# EasyEDA Pro project P1.eprj, board PCB
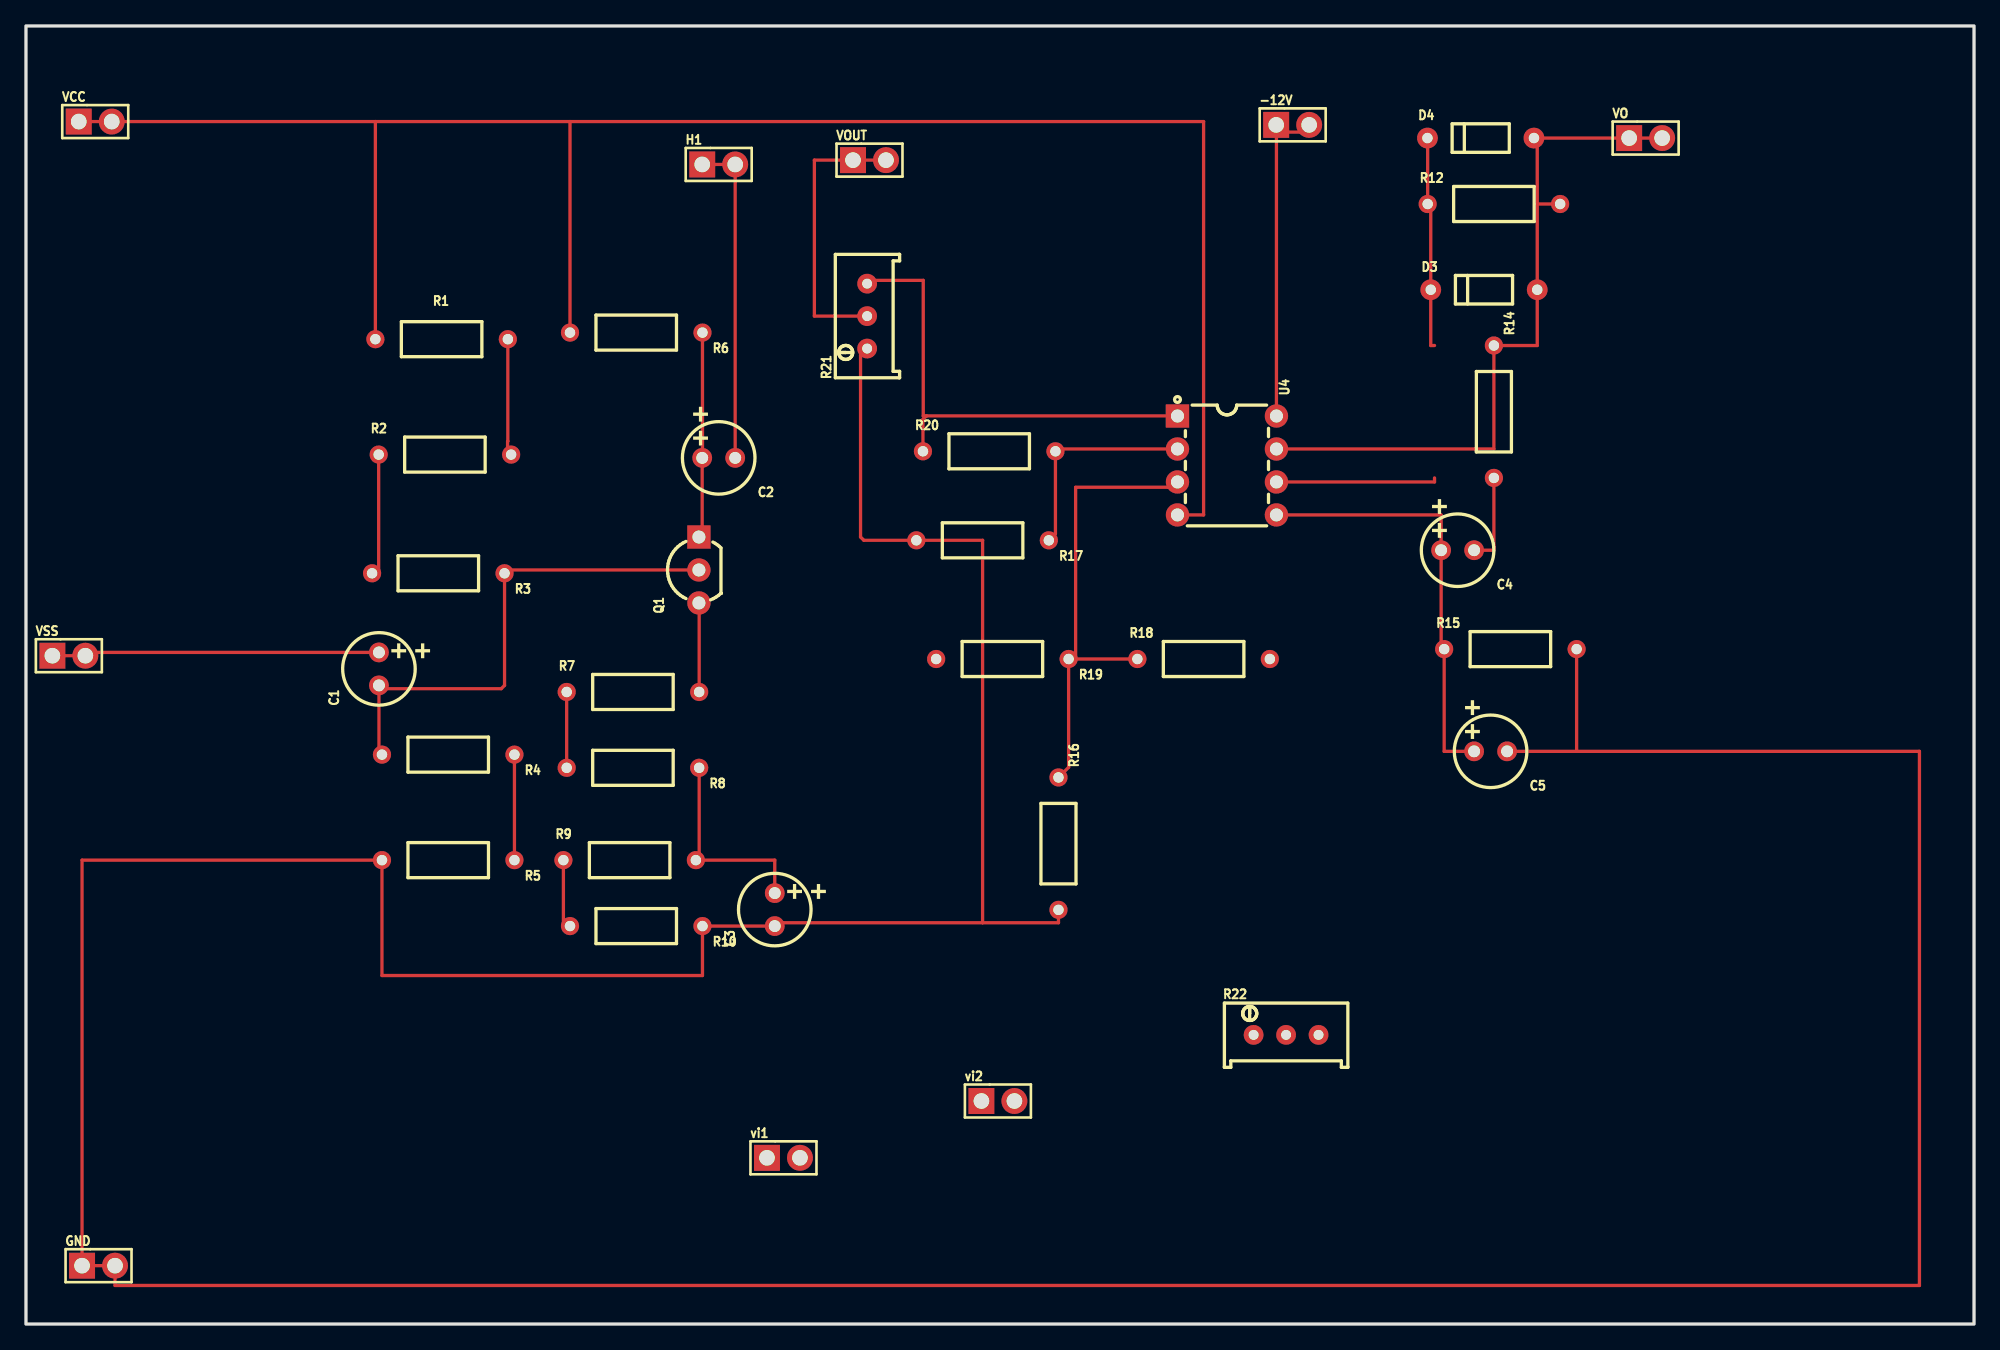
[diagram p6: board, top side]
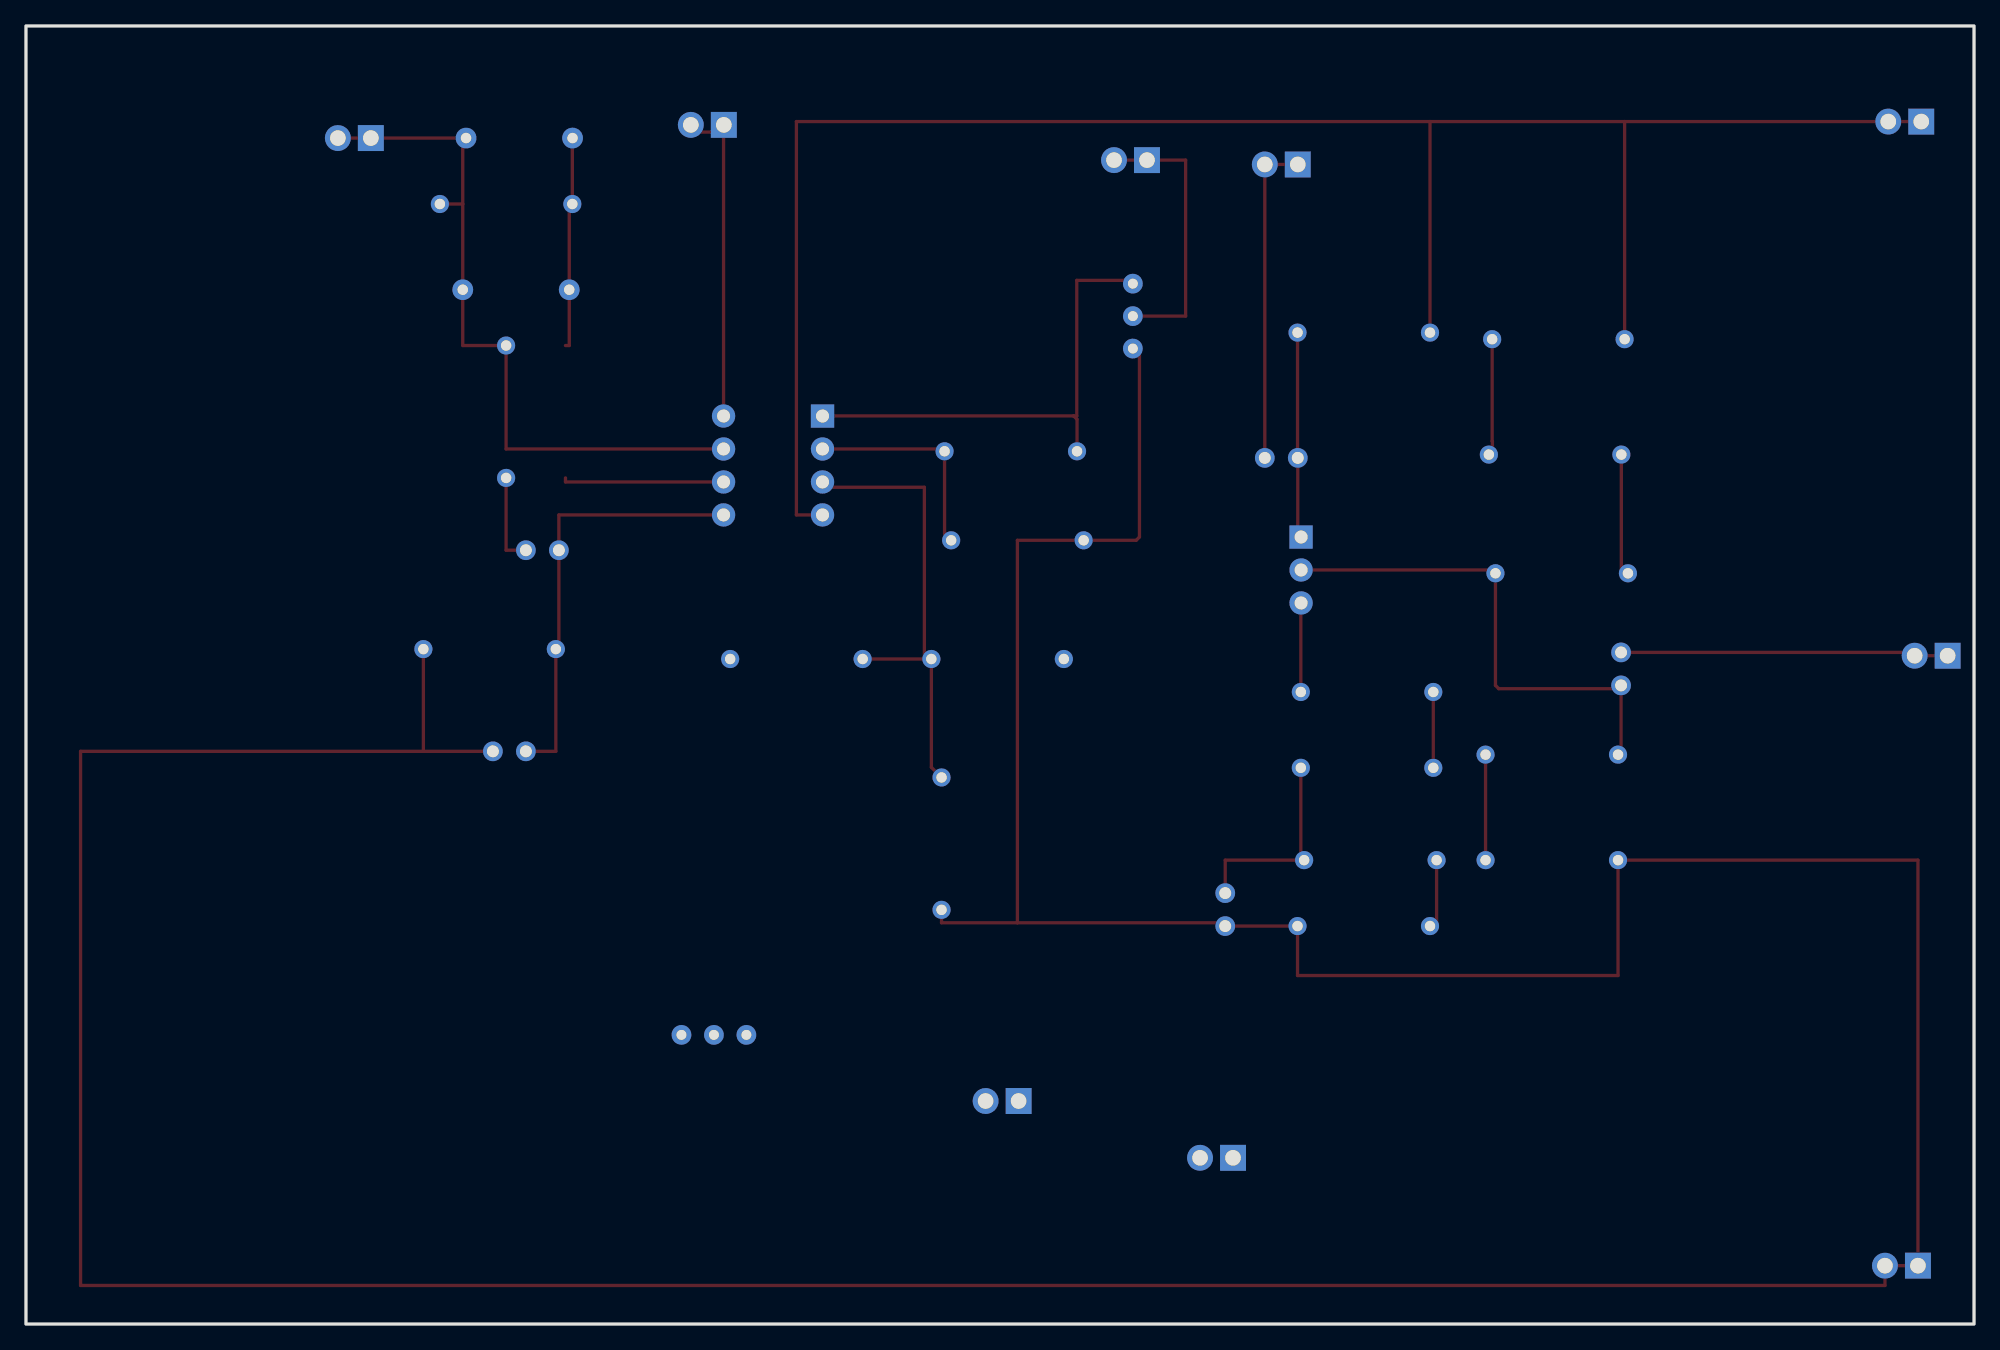
[diagram p7: board, bottom side, seen from below]

Outline 150 x 100 mm; copper layers: Top Layer, Bottom Layer. Coordinates in mm from the lower left corner of the outline.
Outline path: rectangle 0,0 150,100
Stack: Top Layer 0.035mm / Dielectric1 1.51mm FR4 er 4.5 / Bottom Layer 0.035mm

## Design rules (mm)
spacing safeClearance (default): track to track 0.152, other pairs 0.152 to 0.3
track width trackWidth (default): min 0.127, default 0.254, max 2.54
differential pair differentialPair (default): width min 0.127, default 0.254, max 2.54; gap min 0.152, default 0.152
via viaSize (default): diameter min 0.5, default 0.61, max 10; hole min 0.3, default 0.305, max 6

## Placement (name value [footprint] x y rotation side)
-12V  PZ254V-11-02P  [HDR-TH_2P-P2.54-V-M]  97.54 92.38 0 top
C1  10uF  [CAP-TH_BD5.5-P2.54-D0.5-FD]  27.18 50.47 90 top
C2  10uF  [CAP-TH_BD5.5-P2.54-D0.5-FD]  53.34 66.73 180 top
C3  100uF  [CAP-TH_BD5.5-P2.54-D0.5-FD]  57.66 31.93 90 top
C4  0.047uF  [CAP-TH_BD5.5-P2.54-D0.5-FD]  110.24 59.61 180 top
C5  0.047uF  [CAP-TH_BD5.5-P2.54-D0.5-FD]  112.78 44.12 180 top
D3  1N4148  [DO-35_BD2.0-L4.2-P8.20-D0.5-RD]  112.27 79.68 0 top
D4  1N4148  [DO-35_BD2.0-L4.2-P8.20-D0.5-RD]  112.01 91.36 0 top
GND  PZ254V-11-02P  [HDR-TH_2P-P2.54-V-M]  5.59 4.5 0 top
H1  PZ254V-11-02P  [HDR-TH_2P-P2.54-V-M]  53.34 89.33 0 top
Q1  2N2222A  [TO-92-3_L4.8-W3.7-P2.54-R]  51.82 58.09 90 top
R1  51K  [RES-TH_BD2.7-L6.2-P10.20-D0.4]  32 75.87 180 top
R2  51K  [RES-TH_BD2.7-L6.2-P10.20-D0.4]  32.26 66.98 0 top
R3  51K  [RES-TH_BD2.7-L6.2-P10.20-D0.4]  31.75 57.84 180 top
R4  51K  [RES-TH_BD2.7-L6.2-P10.20-D0.4]  32.51 43.87 180 top
R5  15K  [RES-TH_BD2.7-L6.2-P10.20-D0.4]  32.51 35.74 180 top
R6  2.2k  [RES-TH_BD2.7-L6.2-P10.20-D0.4]  46.99 76.38 180 top
R7  100  [RES-TH_BD2.7-L6.2-P10.20-D0.4]  46.74 48.69 0 top
R8  39  [RES-TH_BD2.7-L6.2-P10.20-D0.4]  46.74 42.85 180 top
R9  560  [RES-TH_BD2.7-L6.2-P10.20-D0.4]  46.48 35.74 0 top
R10  220  [RES-TH_BD2.7-L6.2-P10.20-D0.4]  46.99 30.66 180 top
R12  10K  [RES-TH_BD2.7-L6.2-P10.20-D0.4]  113.03 86.28 0 top
R14  3.3k  [RES-TH_BD2.7-L6.2-P10.20-D0.4]  113.03 70.28 270 top
R15  3.3K  [RES-TH_BD2.7-L6.2-P10.20-D0.4]  114.3 51.99 0 top
R16  20k  [RES-TH_BD2.7-L6.2-P10.20-D0.4]  79.5 37.01 270 top
R17  4.7K  [RES-TH_BD2.7-L6.2-P10.20-D0.4]  73.66 60.38 180 top
R18  20k  [RES-TH_BD2.7-L6.2-P10.20-D0.4]  90.68 51.23 0 top
R19  20K  [RES-TH_BD2.7-L6.2-P10.20-D0.4]  75.18 51.23 180 top
R20  47K  [RES-TH_BD2.7-L6.2-P10.20-D0.4]  74.17 67.23 0 top
R21  100kΩ  [RES-ADJ-TH_3P-L10.0-W10.0-P2.50-L]  64.77 77.65 90 top
R22  20kΩ  [RES-ADJ-TH_3P-L10.0-W10.0-P2.50-L]  97.03 22.28 0 top
U4  NE5532N  [DIP-8_L9.3-W6.4-P2.54-LS7.6-BL]  92.48 66.14 270 top
VCC  PZ254V-11-02P  [HDR-TH_2P-P2.54-V-M]  5.33 92.63 0 top
vi1  PZ254V-11-02P  [HDR-TH_2P-P2.54-V-M]  58.33 12.81 0 top
vi2  PZ254V-11-02P  [HDR-TH_2P-P2.54-V-M]  74.84 17.18 0 top
VO  PZ254V-11-02P  [HDR-TH_2P-P2.54-V-M]  124.71 91.36 0 top
VOUT  PZ254V-11-02P  [HDR-TH_2P-P2.54-V-M]  64.95 89.67 0 top
VSS  PZ254V-11-02P  [HDR-TH_2P-P2.54-V-M]  3.3 51.49 0 top

## Footprints (pads in the part's own frame, mm; a bottom-side part is the same pattern mirrored in y, then rotated)
CAP-TH_BD5.5-P2.54-D0.5-FD
  round 1.524 hole 0.914: 1(-1.27,0) 2(1.27,0)
DIP-8_L9.3-W6.4-P2.54-LS7.6-BL
  rect 1.8x1.8 hole 1: 1(-3.81,-3.81)
  round 1.8 hole 1: 2(-1.27,-3.81) 3(1.27,-3.81) 4(3.81,-3.81) 5(3.81,3.81) 6(1.27,3.81) 7(-1.27,3.81) 8(-3.81,3.81)
DO-35_BD2.0-L4.2-P8.20-D0.5-RD
  round 1.6 hole 0.8: 1(-4.1,0) 2(4.1,0)
HDR-TH_2P-P2.54-V-M
  rect 2x2 hole 1.2: 1(-1.27,0)
  round 2 hole 1.2: 2(1.27,0)
RES-ADJ-TH_3P-L10.0-W10.0-P2.50-L
  round 1.524 hole 0.762: 1(-2.5,0) 2(0,0) 3(2.5,0)
RES-TH_BD2.7-L6.2-P10.20-D0.4
  round 1.4 hole 0.8: 1(-5.1,0) 2(5.1,0)
TO-92-3_L4.8-W3.7-P2.54-R
  rect 1.8x1.8 hole 1: 1(2.54,0)
  round 1.8 hole 1: 2(0,0) 3(-2.54,0)

## Nets
As in the schematic.

## Routing (per net, layer and track width the routed paths; a pad name or vN(x,y) marks a point on that pad's centre or on a via; arc(x,y) is an arc through that point)
$1N487: length 9.2
  Top Layer w0.254: R1.1 37.1,68.02 37.08,68 37.08,66.98 R2.2
$1N500: length 9.7
  Top Layer w0.254: R3.2 27.16,57.84 R2.1
$1N505: length 39
  Top Layer w0.254: R4.2 27.18,44.1 C1.1 27.43,48.95 36.6,48.95 36.85,49.2 R3.1 37.1,58.09 Q1.2
$1N510: length 8.1
  Top Layer w0.254: R4.1 R5.1
$1N539: length 25.3
  Top Layer w0.254: C1.2 4.83,51.74 VSS.2 VSS.1
$1N1031: length 16
  Top Layer w0.254: R6.1 52.09,66.75 C2.2 52.07,60.63 Q1.1
$1N1035: length 6.9
  Top Layer w0.254: R7.2 51.84,55.53 Q1.3
$1N1037: length 5.8
  Top Layer w0.254: R7.1 R8.2
$1N1039: length 15.7
  Top Layer w0.254: C3.2 57.66,35.74 51.84,35.74 ; R8.1 51.84,35.74 ; 51.84,35.74 R9.2
$1N1078: length 5.6
  Top Layer w0.254: R9.1 41.38,30.66 R10.2
$1N5445: length 397.8
  Top Layer w0.254: 73.66,30.91 57.66,30.91 C3.1 R10.1 52.09,26.85 27.41,26.85 R5.2 4.32,35.74 GND.1 GND.2 6.86,2.97 145.8,2.97 145.8,44.12 119.4,44.12 ; 73.66,30.91 79.5,30.91 R16.2 ; 73.66,30.91 73.66,60.38 R17.2 64.52,60.38 64.26,60.63 64.26,74.64 R21.1 ; R15.2 119.4,44.12 ; 119.4,44.12 C5.1
$1N5507: length 7.1
  Top Layer w0.254: C4.1 113.03,59.61 R14.2
$1N5529: length 16.5
  Top Layer w0.254: 108.46,75.38 108.17,75.38 D3.1 108.17,86.28 R12.1 107.93,91.36 D4.1
$1N5558: length 12.5
  Top Layer w0.254: U4.6 108.46,64.87 108.46,65.18
$1N5603: length 33.4
  Top Layer w0.254: C5.2 109.2,44.12 R15.1 108.97,51.99 C4.2 108.97,62.33 U4.5
$1N5613: length 151.9
  Top Layer w0.254: U4.4 90.68,62.33 90.68,92.63 41.89,92.63 ; 41.89,92.63 R6.2 ; 41.89,92.63 26.9,92.63 ; 26.9,92.63 VCC.2 VCC.1 ; 26.9,92.63 R1.2
$1N5755: length 25.4
  Top Layer w0.254: U4.8 96.29,92.36 ; 96.29,92.36 96.29,92.38 -12V.1 ; 96.29,92.36 96.82,91.82 98.25,91.82 -12V.2
$1N6867: length 36.3
  Top Layer w0.254: R16.1 80.28,42.89 R19.1 80.82,51.23 ; 80.82,51.23 R18.1 ; 80.82,51.23 80.82,64.46 88.72,64.46 88.72,64.82 U4.3
$1N6870: length 16.5
  Top Layer w0.254: R17.1 79.27,60.88 R20.2 79.45,67.41 U4.2
$1N6998: length 37.3
  Top Layer w0.254: 69.32,69.95 69.09,69.95 69.09,80.4 65.02,80.4 R21.3 ; 69.32,69.95 69.33,69.96 88.66,69.96 U4.1 ; 69.32,69.95 69.07,69.7 R20.1
$1N7213: length 21.6
  Top Layer w0.254: VOUT.2 VOUT.1 60.71,89.67 60.71,77.65 R21.2
$1N8407: length 55.7
  Top Layer w0.254: 116.37,91.36 VO.1 VO.2 ; 116.37,91.36 D4.2 ; 116.37,91.36 116.37,86.28 ; 116.37,86.28 D3.2 116.37,75.38 R14.1 113.03,67.41 U4.7 ; 116.37,86.28 R12.2
$1N8423: length 25.1
  Top Layer w0.254: C2.1 H1.2 H1.1
